# Vivado block design Win_Conditions, xc7a35tcpg236-1, Vivado 2018.3
# (continued, part 2 of 3)
current_bd_instance /Regular_Credit/TRIPLE/TRIPLE_4

# ---- hierarchy /Regular_Credit/TRIPLE/TRIPLE_5 ----
current_bd_instance /Regular_Credit/TRIPLE/TRIPLE_5
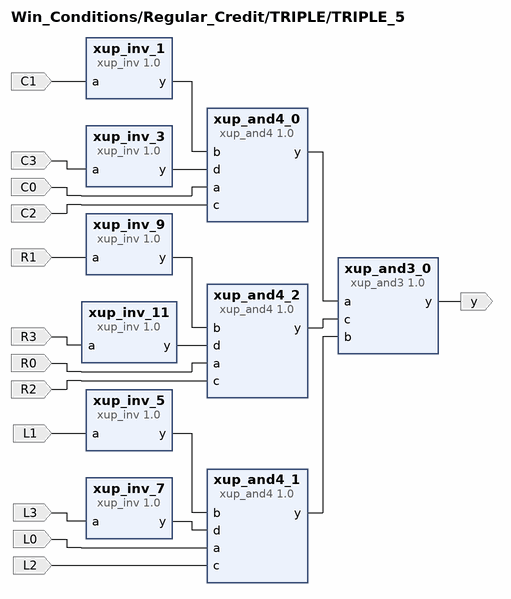
[diagram p22: block diagram inside /Regular_Credit/TRIPLE/TRIPLE_5]
create_bd_pin -dir I C0
create_bd_pin -dir I C1
create_bd_pin -dir I C2
create_bd_pin -dir I C3
create_bd_pin -dir I L0
create_bd_pin -dir I L1
create_bd_pin -dir I L2
create_bd_pin -dir I L3
create_bd_pin -dir I R0
create_bd_pin -dir I R1
create_bd_pin -dir I R2
create_bd_pin -dir I R3
create_bd_pin -dir O y

create_bd_cell -type ip -vlnv xilinx.com:xup:xup_and4:1.0 xup_and4_0
set_property -dict {CONFIG.DELAY 0} [get_bd_cells xup_and4_0]
create_bd_cell -type ip -vlnv xilinx.com:xup:xup_and4:1.0 xup_and4_1
set_property -dict {CONFIG.DELAY 0} [get_bd_cells xup_and4_1]
create_bd_cell -type ip -vlnv xilinx.com:xup:xup_and4:1.0 xup_and4_2
set_property -dict {CONFIG.DELAY 0} [get_bd_cells xup_and4_2]
create_bd_cell -type ip -vlnv xilinx.com:xup:xup_and3:1.0 xup_and3_0
set_property -dict {CONFIG.DELAY 0} [get_bd_cells xup_and3_0]
create_bd_cell -type ip -vlnv xilinx.com:xup:xup_inv:1.0 xup_inv_1
set_property -dict {CONFIG.DELAY 0} [get_bd_cells xup_inv_1]
create_bd_cell -type ip -vlnv xilinx.com:xup:xup_inv:1.0 xup_inv_3
set_property -dict {CONFIG.DELAY 0} [get_bd_cells xup_inv_3]
create_bd_cell -type ip -vlnv xilinx.com:xup:xup_inv:1.0 xup_inv_5
set_property -dict {CONFIG.DELAY 0} [get_bd_cells xup_inv_5]
create_bd_cell -type ip -vlnv xilinx.com:xup:xup_inv:1.0 xup_inv_7
set_property -dict {CONFIG.DELAY 0} [get_bd_cells xup_inv_7]
create_bd_cell -type ip -vlnv xilinx.com:xup:xup_inv:1.0 xup_inv_9
set_property -dict {CONFIG.DELAY 0} [get_bd_cells xup_inv_9]
create_bd_cell -type ip -vlnv xilinx.com:xup:xup_inv:1.0 xup_inv_11
set_property -dict {CONFIG.DELAY 0} [get_bd_cells xup_inv_11]

# ---- hierarchy /Regular_Credit/TRIPLE/TRIPLE_9 ----
current_bd_instance /Regular_Credit/TRIPLE/TRIPLE_9
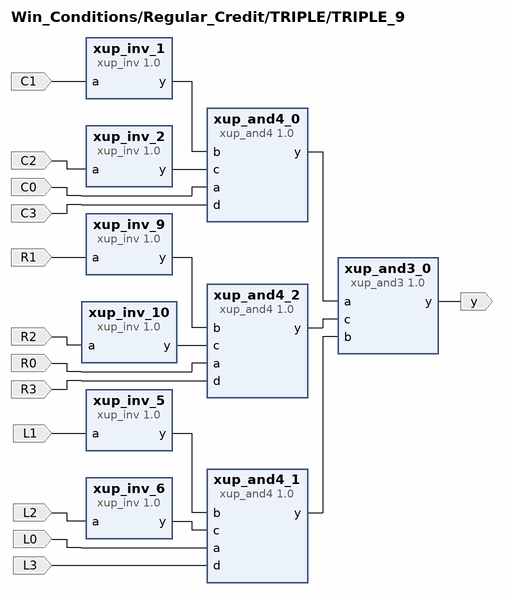
[diagram p23: block diagram inside /Regular_Credit/TRIPLE/TRIPLE_9]
create_bd_pin -dir I C0
create_bd_pin -dir I C1
create_bd_pin -dir I C2
create_bd_pin -dir I C3
create_bd_pin -dir I L0
create_bd_pin -dir I L1
create_bd_pin -dir I L2
create_bd_pin -dir I L3
create_bd_pin -dir I R0
create_bd_pin -dir I R1
create_bd_pin -dir I R2
create_bd_pin -dir I R3
create_bd_pin -dir O y

create_bd_cell -type ip -vlnv xilinx.com:xup:xup_and4:1.0 xup_and4_0
set_property -dict {CONFIG.DELAY 0} [get_bd_cells xup_and4_0]
create_bd_cell -type ip -vlnv xilinx.com:xup:xup_and4:1.0 xup_and4_1
set_property -dict {CONFIG.DELAY 0} [get_bd_cells xup_and4_1]
create_bd_cell -type ip -vlnv xilinx.com:xup:xup_and4:1.0 xup_and4_2
set_property -dict {CONFIG.DELAY 0} [get_bd_cells xup_and4_2]
create_bd_cell -type ip -vlnv xilinx.com:xup:xup_and3:1.0 xup_and3_0
set_property -dict {CONFIG.DELAY 0} [get_bd_cells xup_and3_0]
create_bd_cell -type ip -vlnv xilinx.com:xup:xup_inv:1.0 xup_inv_1
set_property -dict {CONFIG.DELAY 0} [get_bd_cells xup_inv_1]
create_bd_cell -type ip -vlnv xilinx.com:xup:xup_inv:1.0 xup_inv_2
set_property -dict {CONFIG.DELAY 0} [get_bd_cells xup_inv_2]
create_bd_cell -type ip -vlnv xilinx.com:xup:xup_inv:1.0 xup_inv_5
set_property -dict {CONFIG.DELAY 0} [get_bd_cells xup_inv_5]
create_bd_cell -type ip -vlnv xilinx.com:xup:xup_inv:1.0 xup_inv_6
set_property -dict {CONFIG.DELAY 0} [get_bd_cells xup_inv_6]
create_bd_cell -type ip -vlnv xilinx.com:xup:xup_inv:1.0 xup_inv_9
set_property -dict {CONFIG.DELAY 0} [get_bd_cells xup_inv_9]
create_bd_cell -type ip -vlnv xilinx.com:xup:xup_inv:1.0 xup_inv_10
set_property -dict {CONFIG.DELAY 0} [get_bd_cells xup_inv_10]

# ---- connections ----

current_bd_instance /Regular_Credit
connect_bd_net -net DOUBLE_0_y [get_bd_pins DOUBLE/y] [get_bd_pins xup_or5_0/a]
connect_bd_net -net DOUBLE_1_y [get_bd_pins DOUBLE/y1] [get_bd_pins xup_or5_0/b]
connect_bd_net -net DOUBLE_2_y [get_bd_pins DOUBLE/y2] [get_bd_pins xup_or5_0/c]
connect_bd_net -net DOUBLE_3_y [get_bd_pins DOUBLE/y3] [get_bd_pins xup_or5_0/d]
connect_bd_net -net DOUBLE_4_y [get_bd_pins DOUBLE/y4] [get_bd_pins xup_or5_0/e]
connect_bd_net [get_bd_pins xup_or5_0/y] [get_bd_pins xup_or4_0/a]
connect_bd_net -net DOUBLE_5_y [get_bd_pins DOUBLE/y5] [get_bd_pins xup_or5_1/a]
connect_bd_net -net DOUBLE_6_y [get_bd_pins DOUBLE/y6] [get_bd_pins xup_or5_1/b]
connect_bd_net -net DOUBLE_7_y [get_bd_pins DOUBLE/y7] [get_bd_pins xup_or5_1/c]
connect_bd_net -net DOUBLE_8_y [get_bd_pins DOUBLE/y8] [get_bd_pins xup_or5_1/d]
connect_bd_net -net DOUBLE_9_y [get_bd_pins DOUBLE/y9] [get_bd_pins xup_or5_1/e]
connect_bd_net [get_bd_pins xup_or5_1/y] [get_bd_pins xup_or4_0/b]
connect_bd_net -net TRIPLE_0_y [get_bd_pins TRIPLE/y3] [get_bd_pins xup_or5_2/a]
connect_bd_net -net TRIPLE_1_y [get_bd_pins TRIPLE/y4] [get_bd_pins xup_or5_2/b]
connect_bd_net -net TRIPLE_2_y [get_bd_pins TRIPLE/y5] [get_bd_pins xup_or5_2/c]
connect_bd_net -net TRIPLE_3_y [get_bd_pins TRIPLE/y6] [get_bd_pins xup_or5_2/d]
connect_bd_net -net TRIPLE_4_y [get_bd_pins TRIPLE/y7] [get_bd_pins xup_or5_2/e]
connect_bd_net [get_bd_pins xup_or5_2/y] [get_bd_pins xup_or4_0/c]
connect_bd_net -net TRIPLE_5_y [get_bd_pins TRIPLE/y8] [get_bd_pins xup_or5_3/a]
connect_bd_net -net TRIPLE_6_y [get_bd_pins TRIPLE/y] [get_bd_pins xup_or5_3/b]
connect_bd_net -net TRIPLE_7_y [get_bd_pins TRIPLE/y1] [get_bd_pins xup_or5_3/c]
connect_bd_net -net TRIPLE_8_y [get_bd_pins TRIPLE/y2] [get_bd_pins xup_or5_3/d]
connect_bd_net -net TRIPLE_9_y [get_bd_pins TRIPLE/y9] [get_bd_pins xup_or5_3/e]
connect_bd_net [get_bd_pins xup_or5_3/y] [get_bd_pins xup_or4_0/d]
connect_bd_net [get_bd_pins xup_or4_0/y] [get_bd_pins Victory]
connect_bd_net -net a_0_1 [get_bd_pins L3] [get_bd_pins xlconcat_0/In3] [get_bd_pins DOUBLE/L3] [get_bd_pins TRIPLE/L3]
connect_bd_net -net b_0_1 [get_bd_pins L2] [get_bd_pins xlconcat_0/In2] [get_bd_pins DOUBLE/L2] [get_bd_pins TRIPLE/L2]
connect_bd_net -net c_0_1 [get_bd_pins L1] [get_bd_pins xlconcat_0/In1] [get_bd_pins DOUBLE/L1] [get_bd_pins TRIPLE/L1]
connect_bd_net -net d_0_1 [get_bd_pins L0] [get_bd_pins xlconcat_0/In0] [get_bd_pins DOUBLE/L0] [get_bd_pins TRIPLE/L0]
connect_bd_net -net a_0_2 [get_bd_pins C3] [get_bd_pins xlconcat_1/In3] [get_bd_pins DOUBLE/C3] [get_bd_pins TRIPLE/C3]
connect_bd_net -net b_0_2 [get_bd_pins C2] [get_bd_pins xlconcat_1/In2] [get_bd_pins DOUBLE/C2] [get_bd_pins TRIPLE/C2]
connect_bd_net -net c_0_2 [get_bd_pins C1] [get_bd_pins xlconcat_1/In1] [get_bd_pins DOUBLE/C1] [get_bd_pins TRIPLE/C1]
connect_bd_net -net d_0_2 [get_bd_pins C0] [get_bd_pins xlconcat_1/In0] [get_bd_pins DOUBLE/C0] [get_bd_pins TRIPLE/C0]
connect_bd_net -net a_0_3 [get_bd_pins R3] [get_bd_pins xlconcat_2/In3] [get_bd_pins DOUBLE/R3] [get_bd_pins TRIPLE/R3]
connect_bd_net -net b_0_3 [get_bd_pins R2] [get_bd_pins xlconcat_2/In2] [get_bd_pins DOUBLE/R2] [get_bd_pins TRIPLE/R2]
connect_bd_net -net c_0_3 [get_bd_pins R1] [get_bd_pins xlconcat_2/In1] [get_bd_pins DOUBLE/R1] [get_bd_pins TRIPLE/R1]
connect_bd_net -net d_0_3 [get_bd_pins R0] [get_bd_pins xlconcat_2/In0] [get_bd_pins DOUBLE/R0] [get_bd_pins TRIPLE/R0]
connect_bd_net [get_bd_pins xlconcat_0/dout] [get_bd_pins L]
connect_bd_net [get_bd_pins xlconcat_1/dout] [get_bd_pins C]
connect_bd_net [get_bd_pins xlconcat_2/dout] [get_bd_pins R]

current_bd_instance /Regular_Credit/DOUBLE
connect_bd_net -net a_0_1 [get_bd_pins L3] \
  [get_bd_pins DOUBLE_1/L3] [get_bd_pins DOUBLE_3/L3] [get_bd_pins DOUBLE_4/L3] [get_bd_pins DOUBLE_5/L3] \
  [get_bd_pins DOUBLE_6/L3] [get_bd_pins DOUBLE_7/L3] [get_bd_pins DOUBLE_8/L3] [get_bd_pins DOUBLE_9/L3] \
  [get_bd_pins DOUBLE_2/L3] [get_bd_pins DOUBLE_0/L3]
connect_bd_net -net b_0_1 [get_bd_pins L2] \
  [get_bd_pins DOUBLE_1/L2] [get_bd_pins DOUBLE_3/L2] [get_bd_pins DOUBLE_4/L2] [get_bd_pins DOUBLE_5/L2] \
  [get_bd_pins DOUBLE_6/L2] [get_bd_pins DOUBLE_7/L2] [get_bd_pins DOUBLE_8/L2] [get_bd_pins DOUBLE_9/L2] \
  [get_bd_pins DOUBLE_2/L2] [get_bd_pins DOUBLE_0/L2]
connect_bd_net -net c_0_1 [get_bd_pins L1] \
  [get_bd_pins DOUBLE_1/L1] [get_bd_pins DOUBLE_3/L1] [get_bd_pins DOUBLE_4/L1] [get_bd_pins DOUBLE_5/L1] \
  [get_bd_pins DOUBLE_6/L1] [get_bd_pins DOUBLE_7/L1] [get_bd_pins DOUBLE_8/L1] [get_bd_pins DOUBLE_9/L1] \
  [get_bd_pins DOUBLE_2/L1] [get_bd_pins DOUBLE_0/L1]
connect_bd_net -net d_0_1 [get_bd_pins L0] \
  [get_bd_pins DOUBLE_1/L0] [get_bd_pins DOUBLE_3/L0] [get_bd_pins DOUBLE_4/L0] [get_bd_pins DOUBLE_5/L0] \
  [get_bd_pins DOUBLE_6/L0] [get_bd_pins DOUBLE_7/L0] [get_bd_pins DOUBLE_8/L0] [get_bd_pins DOUBLE_9/L0] \
  [get_bd_pins DOUBLE_2/L0] [get_bd_pins DOUBLE_0/L0]
connect_bd_net -net a_0_2 [get_bd_pins C3] \
  [get_bd_pins DOUBLE_1/C3] [get_bd_pins DOUBLE_3/C3] [get_bd_pins DOUBLE_4/C3] [get_bd_pins DOUBLE_5/C3] \
  [get_bd_pins DOUBLE_6/C3] [get_bd_pins DOUBLE_7/C3] [get_bd_pins DOUBLE_8/C3] [get_bd_pins DOUBLE_9/C3] \
  [get_bd_pins DOUBLE_2/C3] [get_bd_pins DOUBLE_0/C3]
connect_bd_net -net b_0_2 [get_bd_pins C2] \
  [get_bd_pins DOUBLE_1/C2] [get_bd_pins DOUBLE_3/C2] [get_bd_pins DOUBLE_4/C2] [get_bd_pins DOUBLE_5/C2] \
  [get_bd_pins DOUBLE_6/C2] [get_bd_pins DOUBLE_7/C2] [get_bd_pins DOUBLE_8/C2] [get_bd_pins DOUBLE_9/C2] \
  [get_bd_pins DOUBLE_2/C2] [get_bd_pins DOUBLE_0/C2]
connect_bd_net -net c_0_2 [get_bd_pins C1] \
  [get_bd_pins DOUBLE_1/C1] [get_bd_pins DOUBLE_3/C1] [get_bd_pins DOUBLE_4/C1] [get_bd_pins DOUBLE_5/C1] \
  [get_bd_pins DOUBLE_6/C1] [get_bd_pins DOUBLE_7/C1] [get_bd_pins DOUBLE_8/C1] [get_bd_pins DOUBLE_9/C1] \
  [get_bd_pins DOUBLE_2/C1] [get_bd_pins DOUBLE_0/C1]
connect_bd_net -net d_0_2 [get_bd_pins C0] \
  [get_bd_pins DOUBLE_1/C0] [get_bd_pins DOUBLE_3/C0] [get_bd_pins DOUBLE_4/C0] [get_bd_pins DOUBLE_5/C0] \
  [get_bd_pins DOUBLE_6/C0] [get_bd_pins DOUBLE_7/C0] [get_bd_pins DOUBLE_8/C0] [get_bd_pins DOUBLE_9/C0] \
  [get_bd_pins DOUBLE_2/C0] [get_bd_pins DOUBLE_0/C0]
connect_bd_net -net a_0_3 [get_bd_pins R3] \
  [get_bd_pins DOUBLE_1/R3] [get_bd_pins DOUBLE_3/R3] [get_bd_pins DOUBLE_4/R3] [get_bd_pins DOUBLE_5/R3] \
  [get_bd_pins DOUBLE_6/R3] [get_bd_pins DOUBLE_7/R3] [get_bd_pins DOUBLE_8/R3] [get_bd_pins DOUBLE_9/R3] \
  [get_bd_pins DOUBLE_2/R3] [get_bd_pins DOUBLE_0/R3]
connect_bd_net -net b_0_3 [get_bd_pins R2] \
  [get_bd_pins DOUBLE_1/R2] [get_bd_pins DOUBLE_3/R2] [get_bd_pins DOUBLE_4/R2] [get_bd_pins DOUBLE_5/R2] \
  [get_bd_pins DOUBLE_6/R2] [get_bd_pins DOUBLE_7/R2] [get_bd_pins DOUBLE_8/R2] [get_bd_pins DOUBLE_9/R2] \
  [get_bd_pins DOUBLE_2/R2] [get_bd_pins DOUBLE_0/R2]
connect_bd_net -net c_0_3 [get_bd_pins R1] \
  [get_bd_pins DOUBLE_1/R1] [get_bd_pins DOUBLE_3/R1] [get_bd_pins DOUBLE_4/R1] [get_bd_pins DOUBLE_5/R1] \
  [get_bd_pins DOUBLE_6/R1] [get_bd_pins DOUBLE_7/R1] [get_bd_pins DOUBLE_8/R1] [get_bd_pins DOUBLE_9/R1] \
  [get_bd_pins DOUBLE_2/R1] [get_bd_pins DOUBLE_0/R1]
connect_bd_net -net d_0_3 [get_bd_pins R0] \
  [get_bd_pins DOUBLE_1/R0] [get_bd_pins DOUBLE_3/R0] [get_bd_pins DOUBLE_4/R0] [get_bd_pins DOUBLE_5/R0] \
  [get_bd_pins DOUBLE_6/R0] [get_bd_pins DOUBLE_7/R0] [get_bd_pins DOUBLE_8/R0] [get_bd_pins DOUBLE_9/R0] \
  [get_bd_pins DOUBLE_2/R0] [get_bd_pins DOUBLE_0/R0]
connect_bd_net [get_bd_pins DOUBLE_0/y] [get_bd_pins y]
connect_bd_net [get_bd_pins DOUBLE_1/y] [get_bd_pins y1]
connect_bd_net [get_bd_pins DOUBLE_2/y] [get_bd_pins y2]
connect_bd_net [get_bd_pins DOUBLE_3/y] [get_bd_pins y3]
connect_bd_net [get_bd_pins DOUBLE_4/y] [get_bd_pins y4]
connect_bd_net [get_bd_pins DOUBLE_5/y] [get_bd_pins y5]
connect_bd_net [get_bd_pins DOUBLE_6/y] [get_bd_pins y6]
connect_bd_net [get_bd_pins DOUBLE_7/y] [get_bd_pins y7]
connect_bd_net [get_bd_pins DOUBLE_8/y] [get_bd_pins y8]
connect_bd_net [get_bd_pins DOUBLE_9/y] [get_bd_pins y9]

current_bd_instance /Regular_Credit/DOUBLE/DOUBLE_0
connect_bd_net [get_bd_pins xup_and4_0/y] [get_bd_pins xup_and2_0/a] [get_bd_pins xup_and2_1/a]
connect_bd_net [get_bd_pins xup_and2_0/y] [get_bd_pins xup_or3_0/a]
connect_bd_net [get_bd_pins xup_and2_1/y] [get_bd_pins xup_or3_0/b]
connect_bd_net [get_bd_pins xup_and2_2/y] [get_bd_pins xup_or3_0/c]
connect_bd_net [get_bd_pins xup_and4_1/y] [get_bd_pins xup_and2_0/b] [get_bd_pins xup_and2_2/a]
connect_bd_net [get_bd_pins xup_and4_3/y] [get_bd_pins xup_and2_1/b] [get_bd_pins xup_and2_2/b]
connect_bd_net -net L3_1 [get_bd_pins L3] [get_bd_pins xup_inv_0/a]
connect_bd_net [get_bd_pins xup_inv_0/y] [get_bd_pins xup_and4_0/a]
connect_bd_net -net L2_1 [get_bd_pins L2] [get_bd_pins xup_inv_1/a]
connect_bd_net [get_bd_pins xup_inv_1/y] [get_bd_pins xup_and4_0/b]
connect_bd_net -net L1_1 [get_bd_pins L1] [get_bd_pins xup_inv_2/a]
connect_bd_net [get_bd_pins xup_inv_2/y] [get_bd_pins xup_and4_0/c]
connect_bd_net -net L0_1 [get_bd_pins L0] [get_bd_pins xup_inv_3/a]
connect_bd_net [get_bd_pins xup_inv_3/y] [get_bd_pins xup_and4_0/d]
connect_bd_net [get_bd_pins xup_inv_4/y] [get_bd_pins xup_and4_3/a]
connect_bd_net [get_bd_pins xup_inv_5/y] [get_bd_pins xup_and4_3/b]
connect_bd_net [get_bd_pins xup_inv_6/y] [get_bd_pins xup_and4_3/c]
connect_bd_net [get_bd_pins xup_inv_7/y] [get_bd_pins xup_and4_3/d]
connect_bd_net -net R3_1 [get_bd_pins R3] [get_bd_pins xup_inv_4/a]
connect_bd_net -net R2_1 [get_bd_pins R2] [get_bd_pins xup_inv_5/a]
connect_bd_net -net R1_1 [get_bd_pins R1] [get_bd_pins xup_inv_6/a]
connect_bd_net -net R0_1 [get_bd_pins R0] [get_bd_pins xup_inv_7/a]
connect_bd_net -net C3_1 [get_bd_pins C3] [get_bd_pins xup_inv_8/a]
connect_bd_net [get_bd_pins xup_inv_8/y] [get_bd_pins xup_and4_1/a]
connect_bd_net -net C2_1 [get_bd_pins C2] [get_bd_pins xup_inv_9/a]
connect_bd_net [get_bd_pins xup_inv_9/y] [get_bd_pins xup_and4_1/b]
connect_bd_net -net C1_1 [get_bd_pins C1] [get_bd_pins xup_inv_10/a]
connect_bd_net [get_bd_pins xup_inv_10/y] [get_bd_pins xup_and4_1/c]
connect_bd_net -net C0_1 [get_bd_pins C0] [get_bd_pins xup_inv_11/a]
connect_bd_net [get_bd_pins xup_inv_11/y] [get_bd_pins xup_and4_1/d]
connect_bd_net [get_bd_pins xup_or3_0/y] [get_bd_pins y]

current_bd_instance /Regular_Credit/DOUBLE/DOUBLE_1
connect_bd_net [get_bd_pins xup_and4_0/y] [get_bd_pins xup_and2_0/a] [get_bd_pins xup_and2_1/a]
connect_bd_net [get_bd_pins xup_and2_0/y] [get_bd_pins xup_or3_0/a]
connect_bd_net [get_bd_pins xup_and2_1/y] [get_bd_pins xup_or3_0/b]
connect_bd_net [get_bd_pins xup_and2_2/y] [get_bd_pins xup_or3_0/c]
connect_bd_net [get_bd_pins xup_and4_1/y] [get_bd_pins xup_and2_0/b] [get_bd_pins xup_and2_2/a]
connect_bd_net [get_bd_pins xup_and4_3/y] [get_bd_pins xup_and2_1/b] [get_bd_pins xup_and2_2/b]
connect_bd_net -net L3_1 [get_bd_pins L3] [get_bd_pins xup_inv_0/a]
connect_bd_net [get_bd_pins xup_inv_0/y] [get_bd_pins xup_and4_0/a]
connect_bd_net -net L2_1 [get_bd_pins L2] [get_bd_pins xup_inv_1/a]
connect_bd_net [get_bd_pins xup_inv_1/y] [get_bd_pins xup_and4_0/b]
connect_bd_net -net L1_1 [get_bd_pins L1] [get_bd_pins xup_inv_2/a]
connect_bd_net [get_bd_pins xup_inv_2/y] [get_bd_pins xup_and4_0/c]
connect_bd_net [get_bd_pins xup_inv_4/y] [get_bd_pins xup_and4_3/a]
connect_bd_net [get_bd_pins xup_inv_5/y] [get_bd_pins xup_and4_3/b]
connect_bd_net [get_bd_pins xup_inv_6/y] [get_bd_pins xup_and4_3/c]
connect_bd_net -net R3_1 [get_bd_pins R3] [get_bd_pins xup_inv_4/a]
connect_bd_net -net R2_1 [get_bd_pins R2] [get_bd_pins xup_inv_5/a]
connect_bd_net -net R1_1 [get_bd_pins R1] [get_bd_pins xup_inv_6/a]
connect_bd_net -net C3_1 [get_bd_pins C3] [get_bd_pins xup_inv_8/a]
connect_bd_net [get_bd_pins xup_inv_8/y] [get_bd_pins xup_and4_1/a]
connect_bd_net -net C2_1 [get_bd_pins C2] [get_bd_pins xup_inv_9/a]
connect_bd_net [get_bd_pins xup_inv_9/y] [get_bd_pins xup_and4_1/b]
connect_bd_net -net C1_1 [get_bd_pins C1] [get_bd_pins xup_inv_10/a]
connect_bd_net [get_bd_pins xup_inv_10/y] [get_bd_pins xup_and4_1/c]
connect_bd_net -net L0_1 [get_bd_pins L0] [get_bd_pins xup_and4_0/d]
connect_bd_net -net C0_1 [get_bd_pins C0] [get_bd_pins xup_and4_1/d]
connect_bd_net -net R0_1 [get_bd_pins R0] [get_bd_pins xup_and4_3/d]
connect_bd_net [get_bd_pins xup_or3_0/y] [get_bd_pins y]

current_bd_instance /Regular_Credit/DOUBLE/DOUBLE_2
connect_bd_net [get_bd_pins xup_and4_0/y] [get_bd_pins xup_and2_0/a] [get_bd_pins xup_and2_1/a]
connect_bd_net [get_bd_pins xup_and2_0/y] [get_bd_pins xup_or3_0/a]
connect_bd_net [get_bd_pins xup_and2_1/y] [get_bd_pins xup_or3_0/b]
connect_bd_net [get_bd_pins xup_and2_2/y] [get_bd_pins xup_or3_0/c]
connect_bd_net [get_bd_pins xup_and4_1/y] [get_bd_pins xup_and2_0/b] [get_bd_pins xup_and2_2/a]
connect_bd_net [get_bd_pins xup_and4_3/y] [get_bd_pins xup_and2_1/b] [get_bd_pins xup_and2_2/b]
connect_bd_net -net L3_1 [get_bd_pins L3] [get_bd_pins xup_inv_0/a]
connect_bd_net [get_bd_pins xup_inv_0/y] [get_bd_pins xup_and4_0/a]
connect_bd_net -net L2_1 [get_bd_pins L2] [get_bd_pins xup_inv_1/a]
connect_bd_net [get_bd_pins xup_inv_1/y] [get_bd_pins xup_and4_0/b]
connect_bd_net -net L0_1 [get_bd_pins L0] [get_bd_pins xup_inv_3/a]
connect_bd_net [get_bd_pins xup_inv_3/y] [get_bd_pins xup_and4_0/d]
connect_bd_net [get_bd_pins xup_inv_4/y] [get_bd_pins xup_and4_3/a]
connect_bd_net [get_bd_pins xup_inv_5/y] [get_bd_pins xup_and4_3/b]
connect_bd_net [get_bd_pins xup_inv_7/y] [get_bd_pins xup_and4_3/d]
connect_bd_net -net R3_1 [get_bd_pins R3] [get_bd_pins xup_inv_4/a]
connect_bd_net -net R2_1 [get_bd_pins R2] [get_bd_pins xup_inv_5/a]
connect_bd_net -net R0_1 [get_bd_pins R0] [get_bd_pins xup_inv_7/a]
connect_bd_net -net C3_1 [get_bd_pins C3] [get_bd_pins xup_inv_8/a]
connect_bd_net [get_bd_pins xup_inv_8/y] [get_bd_pins xup_and4_1/a]
connect_bd_net -net C2_1 [get_bd_pins C2] [get_bd_pins xup_inv_9/a]
connect_bd_net [get_bd_pins xup_inv_9/y] [get_bd_pins xup_and4_1/b]
connect_bd_net -net C0_1 [get_bd_pins C0] [get_bd_pins xup_inv_11/a]
connect_bd_net [get_bd_pins xup_inv_11/y] [get_bd_pins xup_and4_1/d]
connect_bd_net -net L1_1 [get_bd_pins L1] [get_bd_pins xup_and4_0/c]
connect_bd_net -net C1_1 [get_bd_pins C1] [get_bd_pins xup_and4_1/c]
connect_bd_net -net R1_1 [get_bd_pins R1] [get_bd_pins xup_and4_3/c]
connect_bd_net [get_bd_pins xup_or3_0/y] [get_bd_pins y]

current_bd_instance /Regular_Credit/DOUBLE/DOUBLE_3
connect_bd_net [get_bd_pins xup_and4_0/y] [get_bd_pins xup_and2_0/a] [get_bd_pins xup_and2_1/a]
connect_bd_net [get_bd_pins xup_and2_0/y] [get_bd_pins xup_or3_0/a]
connect_bd_net [get_bd_pins xup_and2_1/y] [get_bd_pins xup_or3_0/b]
connect_bd_net [get_bd_pins xup_and2_2/y] [get_bd_pins xup_or3_0/c]
connect_bd_net [get_bd_pins xup_and4_1/y] [get_bd_pins xup_and2_0/b] [get_bd_pins xup_and2_2/a]
connect_bd_net [get_bd_pins xup_and4_3/y] [get_bd_pins xup_and2_1/b] [get_bd_pins xup_and2_2/b]
connect_bd_net -net L3_1 [get_bd_pins L3] [get_bd_pins xup_inv_0/a]
connect_bd_net [get_bd_pins xup_inv_0/y] [get_bd_pins xup_and4_0/a]
connect_bd_net -net L2_1 [get_bd_pins L2] [get_bd_pins xup_inv_1/a]
connect_bd_net [get_bd_pins xup_inv_1/y] [get_bd_pins xup_and4_0/b]
connect_bd_net [get_bd_pins xup_inv_4/y] [get_bd_pins xup_and4_3/a]
connect_bd_net [get_bd_pins xup_inv_5/y] [get_bd_pins xup_and4_3/b]
connect_bd_net -net R3_1 [get_bd_pins R3] [get_bd_pins xup_inv_4/a]
connect_bd_net -net R2_1 [get_bd_pins R2] [get_bd_pins xup_inv_5/a]
connect_bd_net -net C3_1 [get_bd_pins C3] [get_bd_pins xup_inv_8/a]
connect_bd_net [get_bd_pins xup_inv_8/y] [get_bd_pins xup_and4_1/a]
connect_bd_net -net C2_1 [get_bd_pins C2] [get_bd_pins xup_inv_9/a]
connect_bd_net [get_bd_pins xup_inv_9/y] [get_bd_pins xup_and4_1/b]
connect_bd_net -net L1_1 [get_bd_pins L1] [get_bd_pins xup_and4_0/c]
connect_bd_net -net L0_1 [get_bd_pins L0] [get_bd_pins xup_and4_0/d]
connect_bd_net -net C1_1 [get_bd_pins C1] [get_bd_pins xup_and4_1/c]
connect_bd_net -net C0_1 [get_bd_pins C0] [get_bd_pins xup_and4_1/d]
connect_bd_net -net R1_1 [get_bd_pins R1] [get_bd_pins xup_and4_3/c]
connect_bd_net -net R0_1 [get_bd_pins R0] [get_bd_pins xup_and4_3/d]
connect_bd_net [get_bd_pins xup_or3_0/y] [get_bd_pins y]

current_bd_instance /Regular_Credit/DOUBLE/DOUBLE_4
connect_bd_net [get_bd_pins xup_and4_0/y] [get_bd_pins xup_and2_0/a] [get_bd_pins xup_and2_1/a]
connect_bd_net [get_bd_pins xup_and2_0/y] [get_bd_pins xup_or3_0/a]
connect_bd_net [get_bd_pins xup_and2_1/y] [get_bd_pins xup_or3_0/b]
connect_bd_net [get_bd_pins xup_and2_2/y] [get_bd_pins xup_or3_0/c]
connect_bd_net [get_bd_pins xup_and4_1/y] [get_bd_pins xup_and2_0/b] [get_bd_pins xup_and2_2/a]
connect_bd_net [get_bd_pins xup_and4_3/y] [get_bd_pins xup_and2_1/b] [get_bd_pins xup_and2_2/b]
connect_bd_net -net L3_1 [get_bd_pins L3] [get_bd_pins xup_inv_0/a]
connect_bd_net [get_bd_pins xup_inv_0/y] [get_bd_pins xup_and4_0/a]
connect_bd_net -net L1_1 [get_bd_pins L1] [get_bd_pins xup_inv_2/a]
connect_bd_net [get_bd_pins xup_inv_2/y] [get_bd_pins xup_and4_0/c]
connect_bd_net -net L0_1 [get_bd_pins L0] [get_bd_pins xup_inv_3/a]
connect_bd_net [get_bd_pins xup_inv_3/y] [get_bd_pins xup_and4_0/d]
connect_bd_net [get_bd_pins xup_inv_4/y] [get_bd_pins xup_and4_3/a]
connect_bd_net [get_bd_pins xup_inv_6/y] [get_bd_pins xup_and4_3/c]
connect_bd_net [get_bd_pins xup_inv_7/y] [get_bd_pins xup_and4_3/d]
connect_bd_net -net R3_1 [get_bd_pins R3] [get_bd_pins xup_inv_4/a]
connect_bd_net -net R1_1 [get_bd_pins R1] [get_bd_pins xup_inv_6/a]
connect_bd_net -net R0_1 [get_bd_pins R0] [get_bd_pins xup_inv_7/a]
connect_bd_net -net C3_1 [get_bd_pins C3] [get_bd_pins xup_inv_8/a]
connect_bd_net [get_bd_pins xup_inv_8/y] [get_bd_pins xup_and4_1/a]
connect_bd_net -net C1_1 [get_bd_pins C1] [get_bd_pins xup_inv_10/a]
connect_bd_net [get_bd_pins xup_inv_10/y] [get_bd_pins xup_and4_1/c]
connect_bd_net -net C0_1 [get_bd_pins C0] [get_bd_pins xup_inv_11/a]
connect_bd_net [get_bd_pins xup_inv_11/y] [get_bd_pins xup_and4_1/d]
connect_bd_net -net L2_1 [get_bd_pins L2] [get_bd_pins xup_and4_0/b]
connect_bd_net -net C2_1 [get_bd_pins C2] [get_bd_pins xup_and4_1/b]
connect_bd_net -net R2_1 [get_bd_pins R2] [get_bd_pins xup_and4_3/b]
connect_bd_net [get_bd_pins xup_or3_0/y] [get_bd_pins y]

current_bd_instance /Regular_Credit/DOUBLE/DOUBLE_5
connect_bd_net [get_bd_pins xup_and4_0/y] [get_bd_pins xup_and2_0/a] [get_bd_pins xup_and2_1/a]
connect_bd_net [get_bd_pins xup_and2_0/y] [get_bd_pins xup_or3_0/a]
connect_bd_net [get_bd_pins xup_and2_1/y] [get_bd_pins xup_or3_0/b]
connect_bd_net [get_bd_pins xup_and2_2/y] [get_bd_pins xup_or3_0/c]
connect_bd_net [get_bd_pins xup_and4_1/y] [get_bd_pins xup_and2_0/b] [get_bd_pins xup_and2_2/a]
connect_bd_net [get_bd_pins xup_and4_3/y] [get_bd_pins xup_and2_1/b] [get_bd_pins xup_and2_2/b]
connect_bd_net -net L3_1 [get_bd_pins L3] [get_bd_pins xup_inv_0/a]
connect_bd_net [get_bd_pins xup_inv_0/y] [get_bd_pins xup_and4_0/a]
connect_bd_net -net L1_1 [get_bd_pins L1] [get_bd_pins xup_inv_2/a]
connect_bd_net [get_bd_pins xup_inv_2/y] [get_bd_pins xup_and4_0/c]
connect_bd_net [get_bd_pins xup_inv_4/y] [get_bd_pins xup_and4_3/a]
connect_bd_net [get_bd_pins xup_inv_6/y] [get_bd_pins xup_and4_3/c]
connect_bd_net -net R3_1 [get_bd_pins R3] [get_bd_pins xup_inv_4/a]
connect_bd_net -net R1_1 [get_bd_pins R1] [get_bd_pins xup_inv_6/a]
connect_bd_net -net C3_1 [get_bd_pins C3] [get_bd_pins xup_inv_8/a]
connect_bd_net [get_bd_pins xup_inv_8/y] [get_bd_pins xup_and4_1/a]
connect_bd_net -net C1_1 [get_bd_pins C1] [get_bd_pins xup_inv_10/a]
connect_bd_net [get_bd_pins xup_inv_10/y] [get_bd_pins xup_and4_1/c]
connect_bd_net -net L2_1 [get_bd_pins L2] [get_bd_pins xup_and4_0/b]
connect_bd_net -net L0_1 [get_bd_pins L0] [get_bd_pins xup_and4_0/d]
connect_bd_net -net C2_1 [get_bd_pins C2] [get_bd_pins xup_and4_1/b]
connect_bd_net -net C0_1 [get_bd_pins C0] [get_bd_pins xup_and4_1/d]
connect_bd_net -net R2_1 [get_bd_pins R2] [get_bd_pins xup_and4_3/b]
connect_bd_net -net R0_1 [get_bd_pins R0] [get_bd_pins xup_and4_3/d]
connect_bd_net [get_bd_pins xup_or3_0/y] [get_bd_pins y]

current_bd_instance /Regular_Credit/DOUBLE/DOUBLE_6
connect_bd_net [get_bd_pins xup_and4_0/y] [get_bd_pins xup_and2_0/a] [get_bd_pins xup_and2_1/a]
connect_bd_net [get_bd_pins xup_and2_0/y] [get_bd_pins xup_or3_0/a]
connect_bd_net [get_bd_pins xup_and2_1/y] [get_bd_pins xup_or3_0/b]
connect_bd_net [get_bd_pins xup_and2_2/y] [get_bd_pins xup_or3_0/c]
connect_bd_net [get_bd_pins xup_and4_1/y] [get_bd_pins xup_and2_0/b] [get_bd_pins xup_and2_2/a]
connect_bd_net [get_bd_pins xup_and4_3/y] [get_bd_pins xup_and2_1/b] [get_bd_pins xup_and2_2/b]
connect_bd_net -net L3_1 [get_bd_pins L3] [get_bd_pins xup_inv_0/a]
connect_bd_net [get_bd_pins xup_inv_0/y] [get_bd_pins xup_and4_0/a]
connect_bd_net -net L0_1 [get_bd_pins L0] [get_bd_pins xup_inv_3/a]
connect_bd_net [get_bd_pins xup_inv_3/y] [get_bd_pins xup_and4_0/d]
connect_bd_net [get_bd_pins xup_inv_4/y] [get_bd_pins xup_and4_3/a]
connect_bd_net [get_bd_pins xup_inv_7/y] [get_bd_pins xup_and4_3/d]
connect_bd_net -net R3_1 [get_bd_pins R3] [get_bd_pins xup_inv_4/a]
connect_bd_net -net R0_1 [get_bd_pins R0] [get_bd_pins xup_inv_7/a]
connect_bd_net -net C3_1 [get_bd_pins C3] [get_bd_pins xup_inv_8/a]
connect_bd_net [get_bd_pins xup_inv_8/y] [get_bd_pins xup_and4_1/a]
connect_bd_net -net C0_1 [get_bd_pins C0] [get_bd_pins xup_inv_11/a]
connect_bd_net [get_bd_pins xup_inv_11/y] [get_bd_pins xup_and4_1/d]
connect_bd_net -net L2_1 [get_bd_pins L2] [get_bd_pins xup_and4_0/b]
connect_bd_net -net L1_1 [get_bd_pins L1] [get_bd_pins xup_and4_0/c]
connect_bd_net -net C2_1 [get_bd_pins C2] [get_bd_pins xup_and4_1/b]
connect_bd_net -net C1_1 [get_bd_pins C1] [get_bd_pins xup_and4_1/c]
connect_bd_net -net R2_1 [get_bd_pins R2] [get_bd_pins xup_and4_3/b]
connect_bd_net -net R1_1 [get_bd_pins R1] [get_bd_pins xup_and4_3/c]
connect_bd_net [get_bd_pins xup_or3_0/y] [get_bd_pins y]

current_bd_instance /Regular_Credit/DOUBLE/DOUBLE_7
connect_bd_net [get_bd_pins xup_and4_0/y] [get_bd_pins xup_and2_0/a] [get_bd_pins xup_and2_1/a]
connect_bd_net [get_bd_pins xup_and2_0/y] [get_bd_pins xup_or3_0/a]
connect_bd_net [get_bd_pins xup_and2_1/y] [get_bd_pins xup_or3_0/b]
connect_bd_net [get_bd_pins xup_and2_2/y] [get_bd_pins xup_or3_0/c]
connect_bd_net [get_bd_pins xup_and4_1/y] [get_bd_pins xup_and2_0/b] [get_bd_pins xup_and2_2/a]
connect_bd_net [get_bd_pins xup_and4_3/y] [get_bd_pins xup_and2_1/b] [get_bd_pins xup_and2_2/b]
connect_bd_net -net L3_1 [get_bd_pins L3] [get_bd_pins xup_inv_0/a]
connect_bd_net [get_bd_pins xup_inv_0/y] [get_bd_pins xup_and4_0/a]
connect_bd_net [get_bd_pins xup_inv_4/y] [get_bd_pins xup_and4_3/a]
connect_bd_net -net R3_1 [get_bd_pins R3] [get_bd_pins xup_inv_4/a]
connect_bd_net -net C3_1 [get_bd_pins C3] [get_bd_pins xup_inv_8/a]
connect_bd_net [get_bd_pins xup_inv_8/y] [get_bd_pins xup_and4_1/a]
connect_bd_net -net L2_1 [get_bd_pins L2] [get_bd_pins xup_and4_0/b]
connect_bd_net -net L1_1 [get_bd_pins L1] [get_bd_pins xup_and4_0/c]
connect_bd_net -net L0_1 [get_bd_pins L0] [get_bd_pins xup_and4_0/d]
connect_bd_net -net C2_1 [get_bd_pins C2] [get_bd_pins xup_and4_1/b]
connect_bd_net -net C1_1 [get_bd_pins C1] [get_bd_pins xup_and4_1/c]
connect_bd_net -net C0_1 [get_bd_pins C0] [get_bd_pins xup_and4_1/d]
connect_bd_net -net R2_1 [get_bd_pins R2] [get_bd_pins xup_and4_3/b]
connect_bd_net -net R1_1 [get_bd_pins R1] [get_bd_pins xup_and4_3/c]
connect_bd_net -net R0_1 [get_bd_pins R0] [get_bd_pins xup_and4_3/d]
connect_bd_net [get_bd_pins xup_or3_0/y] [get_bd_pins y]

current_bd_instance /Regular_Credit/DOUBLE/DOUBLE_8
connect_bd_net [get_bd_pins xup_and4_0/y] [get_bd_pins xup_and2_0/a] [get_bd_pins xup_and2_1/a]
connect_bd_net [get_bd_pins xup_and2_0/y] [get_bd_pins xup_or3_0/a]
connect_bd_net [get_bd_pins xup_and2_1/y] [get_bd_pins xup_or3_0/b]
connect_bd_net [get_bd_pins xup_and2_2/y] [get_bd_pins xup_or3_0/c]
connect_bd_net [get_bd_pins xup_and4_1/y] [get_bd_pins xup_and2_0/b] [get_bd_pins xup_and2_2/a]
connect_bd_net [get_bd_pins xup_and4_3/y] [get_bd_pins xup_and2_1/b] [get_bd_pins xup_and2_2/b]
connect_bd_net -net L2_1 [get_bd_pins L2] [get_bd_pins xup_inv_1/a]
connect_bd_net [get_bd_pins xup_inv_1/y] [get_bd_pins xup_and4_0/b]
connect_bd_net -net L1_1 [get_bd_pins L1] [get_bd_pins xup_inv_2/a]
connect_bd_net [get_bd_pins xup_inv_2/y] [get_bd_pins xup_and4_0/c]
connect_bd_net -net L0_1 [get_bd_pins L0] [get_bd_pins xup_inv_3/a]
connect_bd_net [get_bd_pins xup_inv_3/y] [get_bd_pins xup_and4_0/d]
connect_bd_net [get_bd_pins xup_inv_5/y] [get_bd_pins xup_and4_3/b]
connect_bd_net [get_bd_pins xup_inv_6/y] [get_bd_pins xup_and4_3/c]
connect_bd_net [get_bd_pins xup_inv_7/y] [get_bd_pins xup_and4_3/d]
connect_bd_net -net R2_1 [get_bd_pins R2] [get_bd_pins xup_inv_5/a]
connect_bd_net -net R1_1 [get_bd_pins R1] [get_bd_pins xup_inv_6/a]
connect_bd_net -net R0_1 [get_bd_pins R0] [get_bd_pins xup_inv_7/a]
connect_bd_net -net C2_1 [get_bd_pins C2] [get_bd_pins xup_inv_9/a]
connect_bd_net [get_bd_pins xup_inv_9/y] [get_bd_pins xup_and4_1/b]
connect_bd_net -net C1_1 [get_bd_pins C1] [get_bd_pins xup_inv_10/a]
connect_bd_net [get_bd_pins xup_inv_10/y] [get_bd_pins xup_and4_1/c]
connect_bd_net -net C0_1 [get_bd_pins C0] [get_bd_pins xup_inv_11/a]
connect_bd_net [get_bd_pins xup_inv_11/y] [get_bd_pins xup_and4_1/d]
connect_bd_net -net L3_1 [get_bd_pins L3] [get_bd_pins xup_and4_0/a]
connect_bd_net -net C3_1 [get_bd_pins C3] [get_bd_pins xup_and4_1/a]
connect_bd_net -net R3_1 [get_bd_pins R3] [get_bd_pins xup_and4_3/a]
connect_bd_net [get_bd_pins xup_or3_0/y] [get_bd_pins y]

current_bd_instance /Regular_Credit/DOUBLE/DOUBLE_9
connect_bd_net [get_bd_pins xup_and4_0/y] [get_bd_pins xup_and2_0/a] [get_bd_pins xup_and2_1/a]
connect_bd_net [get_bd_pins xup_and2_0/y] [get_bd_pins xup_or3_0/a]
connect_bd_net [get_bd_pins xup_and2_1/y] [get_bd_pins xup_or3_0/b]
connect_bd_net [get_bd_pins xup_and2_2/y] [get_bd_pins xup_or3_0/c]
connect_bd_net [get_bd_pins xup_and4_1/y] [get_bd_pins xup_and2_0/b] [get_bd_pins xup_and2_2/a]
connect_bd_net [get_bd_pins xup_and4_3/y] [get_bd_pins xup_and2_1/b] [get_bd_pins xup_and2_2/b]
connect_bd_net -net L2_1 [get_bd_pins L2] [get_bd_pins xup_inv_1/a]
connect_bd_net [get_bd_pins xup_inv_1/y] [get_bd_pins xup_and4_0/b]
connect_bd_net -net L1_1 [get_bd_pins L1] [get_bd_pins xup_inv_2/a]
connect_bd_net [get_bd_pins xup_inv_2/y] [get_bd_pins xup_and4_0/c]
connect_bd_net [get_bd_pins xup_inv_5/y] [get_bd_pins xup_and4_3/b]
connect_bd_net [get_bd_pins xup_inv_6/y] [get_bd_pins xup_and4_3/c]
connect_bd_net -net R2_1 [get_bd_pins R2] [get_bd_pins xup_inv_5/a]
connect_bd_net -net R1_1 [get_bd_pins R1] [get_bd_pins xup_inv_6/a]
connect_bd_net -net C2_1 [get_bd_pins C2] [get_bd_pins xup_inv_9/a]
connect_bd_net [get_bd_pins xup_inv_9/y] [get_bd_pins xup_and4_1/b]
connect_bd_net -net C1_1 [get_bd_pins C1] [get_bd_pins xup_inv_10/a]
connect_bd_net [get_bd_pins xup_inv_10/y] [get_bd_pins xup_and4_1/c]
connect_bd_net -net L3_1 [get_bd_pins L3] [get_bd_pins xup_and4_0/a]
connect_bd_net -net L0_1 [get_bd_pins L0] [get_bd_pins xup_and4_0/d]
connect_bd_net -net C3_1 [get_bd_pins C3] [get_bd_pins xup_and4_1/a]
connect_bd_net -net C0_1 [get_bd_pins C0] [get_bd_pins xup_and4_1/d]
connect_bd_net -net R3_1 [get_bd_pins R3] [get_bd_pins xup_and4_3/a]
connect_bd_net -net R0_1 [get_bd_pins R0] [get_bd_pins xup_and4_3/d]
connect_bd_net [get_bd_pins xup_or3_0/y] [get_bd_pins y]

current_bd_instance /Regular_Credit/TRIPLE
connect_bd_net -net d_0_2 [get_bd_pins C0] \
  [get_bd_pins TRIPLE_0/C0] [get_bd_pins TRIPLE_2/C0] [get_bd_pins TRIPLE_3/C0] [get_bd_pins TRIPLE_7/C0] \
  [get_bd_pins TRIPLE_5/C0] [get_bd_pins TRIPLE_1/C0] [get_bd_pins TRIPLE_8/C0] [get_bd_pins TRIPLE_9/C0] \
  [get_bd_pins TRIPLE_4/C0] [get_bd_pins TRIPLE_6/C0]
connect_bd_net -net c_0_2 [get_bd_pins C1] \
  [get_bd_pins TRIPLE_0/C1] [get_bd_pins TRIPLE_2/C1] [get_bd_pins TRIPLE_3/C1] [get_bd_pins TRIPLE_7/C1] \
  [get_bd_pins TRIPLE_5/C1] [get_bd_pins TRIPLE_1/C1] [get_bd_pins TRIPLE_8/C1] [get_bd_pins TRIPLE_9/C1] \
  [get_bd_pins TRIPLE_4/C1] [get_bd_pins TRIPLE_6/C1]
connect_bd_net -net b_0_2 [get_bd_pins C2] \
  [get_bd_pins TRIPLE_0/C2] [get_bd_pins TRIPLE_2/C2] [get_bd_pins TRIPLE_3/C2] [get_bd_pins TRIPLE_7/C2] \
  [get_bd_pins TRIPLE_5/C2] [get_bd_pins TRIPLE_1/C2] [get_bd_pins TRIPLE_8/C2] [get_bd_pins TRIPLE_9/C2] \
  [get_bd_pins TRIPLE_4/C2] [get_bd_pins TRIPLE_6/C2]
connect_bd_net -net a_0_2 [get_bd_pins C3] \
  [get_bd_pins TRIPLE_0/C3] [get_bd_pins TRIPLE_2/C3] [get_bd_pins TRIPLE_3/C3] [get_bd_pins TRIPLE_7/C3] \
  [get_bd_pins TRIPLE_5/C3] [get_bd_pins TRIPLE_1/C3] [get_bd_pins TRIPLE_8/C3] [get_bd_pins TRIPLE_9/C3] \
  [get_bd_pins TRIPLE_4/C3] [get_bd_pins TRIPLE_6/C3]
connect_bd_net -net d_0_1 [get_bd_pins L0] \
  [get_bd_pins TRIPLE_0/L0] [get_bd_pins TRIPLE_2/L0] [get_bd_pins TRIPLE_3/L0] [get_bd_pins TRIPLE_7/L0] \
  [get_bd_pins TRIPLE_5/L0] [get_bd_pins TRIPLE_1/L0] [get_bd_pins TRIPLE_8/L0] [get_bd_pins TRIPLE_9/L0] \
  [get_bd_pins TRIPLE_4/L0] [get_bd_pins TRIPLE_6/L0]
connect_bd_net -net c_0_1 [get_bd_pins L1] \
  [get_bd_pins TRIPLE_0/L1] [get_bd_pins TRIPLE_2/L1] [get_bd_pins TRIPLE_3/L1] [get_bd_pins TRIPLE_7/L1] \
  [get_bd_pins TRIPLE_5/L1] [get_bd_pins TRIPLE_1/L1] [get_bd_pins TRIPLE_8/L1] [get_bd_pins TRIPLE_9/L1] \
  [get_bd_pins TRIPLE_4/L1] [get_bd_pins TRIPLE_6/L1]
connect_bd_net -net b_0_1 [get_bd_pins L2] \
  [get_bd_pins TRIPLE_0/L2] [get_bd_pins TRIPLE_2/L2] [get_bd_pins TRIPLE_3/L2] [get_bd_pins TRIPLE_7/L2] \
  [get_bd_pins TRIPLE_5/L2] [get_bd_pins TRIPLE_1/L2] [get_bd_pins TRIPLE_8/L2] [get_bd_pins TRIPLE_9/L2] \
  [get_bd_pins TRIPLE_4/L2] [get_bd_pins TRIPLE_6/L2]
connect_bd_net -net a_0_1 [get_bd_pins L3] \
  [get_bd_pins TRIPLE_0/L3] [get_bd_pins TRIPLE_2/L3] [get_bd_pins TRIPLE_3/L3] [get_bd_pins TRIPLE_7/L3] \
  [get_bd_pins TRIPLE_5/L3] [get_bd_pins TRIPLE_1/L3] [get_bd_pins TRIPLE_8/L3] [get_bd_pins TRIPLE_9/L3] \
  [get_bd_pins TRIPLE_4/L3] [get_bd_pins TRIPLE_6/L3]
connect_bd_net -net d_0_3 [get_bd_pins R0] \
  [get_bd_pins TRIPLE_0/R0] [get_bd_pins TRIPLE_2/R0] [get_bd_pins TRIPLE_3/R0] [get_bd_pins TRIPLE_7/R0] \
  [get_bd_pins TRIPLE_5/R0] [get_bd_pins TRIPLE_1/R0] [get_bd_pins TRIPLE_8/R0] [get_bd_pins TRIPLE_9/R0] \
  [get_bd_pins TRIPLE_4/R0] [get_bd_pins TRIPLE_6/R0]
connect_bd_net -net c_0_3 [get_bd_pins R1] \
  [get_bd_pins TRIPLE_0/R1] [get_bd_pins TRIPLE_2/R1] [get_bd_pins TRIPLE_3/R1] [get_bd_pins TRIPLE_7/R1] \
  [get_bd_pins TRIPLE_5/R1] [get_bd_pins TRIPLE_1/R1] [get_bd_pins TRIPLE_8/R1] [get_bd_pins TRIPLE_9/R1] \
  [get_bd_pins TRIPLE_4/R1] [get_bd_pins TRIPLE_6/R1]
connect_bd_net -net b_0_3 [get_bd_pins R2] \
  [get_bd_pins TRIPLE_0/R2] [get_bd_pins TRIPLE_2/R2] [get_bd_pins TRIPLE_3/R2] [get_bd_pins TRIPLE_7/R2] \
  [get_bd_pins TRIPLE_5/R2] [get_bd_pins TRIPLE_1/R2] [get_bd_pins TRIPLE_8/R2] [get_bd_pins TRIPLE_9/R2] \
  [get_bd_pins TRIPLE_4/R2] [get_bd_pins TRIPLE_6/R2]
connect_bd_net -net a_0_3 [get_bd_pins R3] \
  [get_bd_pins TRIPLE_0/R3] [get_bd_pins TRIPLE_2/R3] [get_bd_pins TRIPLE_3/R3] [get_bd_pins TRIPLE_7/R3] \
  [get_bd_pins TRIPLE_5/R3] [get_bd_pins TRIPLE_1/R3] [get_bd_pins TRIPLE_8/R3] [get_bd_pins TRIPLE_9/R3] \
  [get_bd_pins TRIPLE_4/R3] [get_bd_pins TRIPLE_6/R3]
connect_bd_net [get_bd_pins TRIPLE_6/y] [get_bd_pins y]
connect_bd_net [get_bd_pins TRIPLE_7/y] [get_bd_pins y1]
connect_bd_net [get_bd_pins TRIPLE_8/y] [get_bd_pins y2]
connect_bd_net [get_bd_pins TRIPLE_0/y] [get_bd_pins y3]
connect_bd_net [get_bd_pins TRIPLE_1/y] [get_bd_pins y4]
connect_bd_net [get_bd_pins TRIPLE_2/y] [get_bd_pins y5]
connect_bd_net [get_bd_pins TRIPLE_3/y] [get_bd_pins y6]
connect_bd_net [get_bd_pins TRIPLE_4/y] [get_bd_pins y7]
connect_bd_net [get_bd_pins TRIPLE_5/y] [get_bd_pins y8]
connect_bd_net [get_bd_pins TRIPLE_9/y] [get_bd_pins y9]

current_bd_instance /Regular_Credit/TRIPLE/TRIPLE_6
connect_bd_net [get_bd_pins xup_and4_0/y] [get_bd_pins xup_and3_0/a]
connect_bd_net [get_bd_pins xup_and4_1/y] [get_bd_pins xup_and3_0/b]
connect_bd_net [get_bd_pins xup_and4_2/y] [get_bd_pins xup_and3_0/c]
connect_bd_net -net C0_1 [get_bd_pins C0] [get_bd_pins xup_inv_0/a]
connect_bd_net [get_bd_pins xup_inv_0/y] [get_bd_pins xup_and4_0/a]
connect_bd_net -net C3_1 [get_bd_pins C3] [get_bd_pins xup_inv_3/a]
connect_bd_net [get_bd_pins xup_inv_3/y] [get_bd_pins xup_and4_0/d]
connect_bd_net -net L0_1 [get_bd_pins L0] [get_bd_pins xup_inv_4/a]
connect_bd_net [get_bd_pins xup_inv_4/y] [get_bd_pins xup_and4_1/a]
connect_bd_net -net L3_1 [get_bd_pins L3] [get_bd_pins xup_inv_7/a]
connect_bd_net [get_bd_pins xup_inv_7/y] [get_bd_pins xup_and4_1/d]
connect_bd_net -net R0_1 [get_bd_pins R0] [get_bd_pins xup_inv_8/a]
connect_bd_net [get_bd_pins xup_inv_8/y] [get_bd_pins xup_and4_2/a]
connect_bd_net -net R3_1 [get_bd_pins R3] [get_bd_pins xup_inv_11/a]
connect_bd_net [get_bd_pins xup_inv_11/y] [get_bd_pins xup_and4_2/d]
connect_bd_net -net C1_1 [get_bd_pins C1] [get_bd_pins xup_and4_0/b]
connect_bd_net -net C2_1 [get_bd_pins C2] [get_bd_pins xup_and4_0/c]
connect_bd_net -net L1_1 [get_bd_pins L1] [get_bd_pins xup_and4_1/b]
connect_bd_net -net L2_1 [get_bd_pins L2] [get_bd_pins xup_and4_1/c]
connect_bd_net -net R1_1 [get_bd_pins R1] [get_bd_pins xup_and4_2/b]
connect_bd_net -net R2_1 [get_bd_pins R2] [get_bd_pins xup_and4_2/c]
connect_bd_net [get_bd_pins xup_and3_0/y] [get_bd_pins y]

current_bd_instance /Regular_Credit/TRIPLE/TRIPLE_7
connect_bd_net [get_bd_pins xup_and4_0/y] [get_bd_pins xup_and3_0/a]
connect_bd_net [get_bd_pins xup_and4_1/y] [get_bd_pins xup_and3_0/b]
connect_bd_net [get_bd_pins xup_and4_2/y] [get_bd_pins xup_and3_0/c]
connect_bd_net -net C3_1 [get_bd_pins C3] [get_bd_pins xup_inv_3/a]
connect_bd_net [get_bd_pins xup_inv_3/y] [get_bd_pins xup_and4_0/d]
connect_bd_net -net L3_1 [get_bd_pins L3] [get_bd_pins xup_inv_7/a]
connect_bd_net [get_bd_pins xup_inv_7/y] [get_bd_pins xup_and4_1/d]
connect_bd_net -net R3_1 [get_bd_pins R3] [get_bd_pins xup_inv_11/a]
connect_bd_net [get_bd_pins xup_inv_11/y] [get_bd_pins xup_and4_2/d]
connect_bd_net -net C0_1 [get_bd_pins C0] [get_bd_pins xup_and4_0/a]
connect_bd_net -net C1_1 [get_bd_pins C1] [get_bd_pins xup_and4_0/b]
connect_bd_net -net C2_1 [get_bd_pins C2] [get_bd_pins xup_and4_0/c]
connect_bd_net -net L0_1 [get_bd_pins L0] [get_bd_pins xup_and4_1/a]
connect_bd_net -net L1_1 [get_bd_pins L1] [get_bd_pins xup_and4_1/b]
connect_bd_net -net L2_1 [get_bd_pins L2] [get_bd_pins xup_and4_1/c]
connect_bd_net -net R0_1 [get_bd_pins R0] [get_bd_pins xup_and4_2/a]
connect_bd_net -net R1_1 [get_bd_pins R1] [get_bd_pins xup_and4_2/b]
connect_bd_net -net R2_1 [get_bd_pins R2] [get_bd_pins xup_and4_2/c]
connect_bd_net [get_bd_pins xup_and3_0/y] [get_bd_pins y]

current_bd_instance /Regular_Credit/TRIPLE/TRIPLE_8
connect_bd_net [get_bd_pins xup_and4_0/y] [get_bd_pins xup_and3_0/a]
connect_bd_net [get_bd_pins xup_and4_1/y] [get_bd_pins xup_and3_0/b]
connect_bd_net [get_bd_pins xup_and4_2/y] [get_bd_pins xup_and3_0/c]
connect_bd_net -net R2_1 [get_bd_pins R2] [get_bd_pins xup_inv_10/a]
connect_bd_net -net R0_1 [get_bd_pins R0] [get_bd_pins xup_inv_8/a]
connect_bd_net [get_bd_pins xup_inv_4/y] [get_bd_pins xup_and4_1/a]
connect_bd_net -net C2_1 [get_bd_pins C2] [get_bd_pins xup_inv_2/a]
connect_bd_net -net C1_1 [get_bd_pins C1] [get_bd_pins xup_inv_1/a]
connect_bd_net [get_bd_pins xup_inv_9/y] [get_bd_pins xup_and4_2/b]
connect_bd_net -net R1_1 [get_bd_pins R1] [get_bd_pins xup_inv_9/a]
connect_bd_net [get_bd_pins xup_inv_6/y] [get_bd_pins xup_and4_1/c]
connect_bd_net -net L1_1 [get_bd_pins L1] [get_bd_pins xup_inv_5/a]
connect_bd_net [get_bd_pins xup_inv_0/y] [get_bd_pins xup_and4_0/a]
connect_bd_net [get_bd_pins xup_inv_10/y] [get_bd_pins xup_and4_2/c]
connect_bd_net [get_bd_pins xup_inv_8/y] [get_bd_pins xup_and4_2/a]
connect_bd_net -net L2_1 [get_bd_pins L2] [get_bd_pins xup_inv_6/a]
connect_bd_net [get_bd_pins xup_inv_5/y] [get_bd_pins xup_and4_1/b]
connect_bd_net -net L0_1 [get_bd_pins L0] [get_bd_pins xup_inv_4/a]
connect_bd_net [get_bd_pins xup_inv_1/y] [get_bd_pins xup_and4_0/b]
connect_bd_net [get_bd_pins xup_inv_2/y] [get_bd_pins xup_and4_0/c]
connect_bd_net -net C0_1 [get_bd_pins C0] [get_bd_pins xup_inv_0/a]
connect_bd_net -net C3_1 [get_bd_pins C3] [get_bd_pins xup_and4_0/d]
connect_bd_net -net L3_1 [get_bd_pins L3] [get_bd_pins xup_and4_1/d]
connect_bd_net -net R3_1 [get_bd_pins R3] [get_bd_pins xup_and4_2/d]
connect_bd_net [get_bd_pins xup_and3_0/y] [get_bd_pins y]

current_bd_instance /Regular_Credit/TRIPLE/TRIPLE_0
connect_bd_net [get_bd_pins xup_and4_0/y] [get_bd_pins xup_and3_0/a]
connect_bd_net [get_bd_pins xup_and4_1/y] [get_bd_pins xup_and3_0/b]
connect_bd_net [get_bd_pins xup_and4_2/y] [get_bd_pins xup_and3_0/c]
connect_bd_net -net C0_1 [get_bd_pins C0] [get_bd_pins xup_inv_0/a]
connect_bd_net [get_bd_pins xup_inv_0/y] [get_bd_pins xup_and4_0/a]
connect_bd_net -net C1_1 [get_bd_pins C1] [get_bd_pins xup_inv_1/a]
connect_bd_net [get_bd_pins xup_inv_1/y] [get_bd_pins xup_and4_0/b]
connect_bd_net -net C2_1 [get_bd_pins C2] [get_bd_pins xup_inv_2/a]
connect_bd_net [get_bd_pins xup_inv_2/y] [get_bd_pins xup_and4_0/c]
connect_bd_net -net C3_1 [get_bd_pins C3] [get_bd_pins xup_inv_3/a]
connect_bd_net [get_bd_pins xup_inv_3/y] [get_bd_pins xup_and4_0/d]
connect_bd_net -net L0_1 [get_bd_pins L0] [get_bd_pins xup_inv_4/a]
connect_bd_net [get_bd_pins xup_inv_4/y] [get_bd_pins xup_and4_1/a]
connect_bd_net -net L1_1 [get_bd_pins L1] [get_bd_pins xup_inv_5/a]
connect_bd_net [get_bd_pins xup_inv_5/y] [get_bd_pins xup_and4_1/b]
connect_bd_net -net L2_1 [get_bd_pins L2] [get_bd_pins xup_inv_6/a]
connect_bd_net [get_bd_pins xup_inv_6/y] [get_bd_pins xup_and4_1/c]
connect_bd_net -net L3_1 [get_bd_pins L3] [get_bd_pins xup_inv_7/a]
connect_bd_net [get_bd_pins xup_inv_7/y] [get_bd_pins xup_and4_1/d]
connect_bd_net -net R0_1 [get_bd_pins R0] [get_bd_pins xup_inv_8/a]
connect_bd_net [get_bd_pins xup_inv_8/y] [get_bd_pins xup_and4_2/a]
connect_bd_net -net R1_1 [get_bd_pins R1] [get_bd_pins xup_inv_9/a]
connect_bd_net [get_bd_pins xup_inv_9/y] [get_bd_pins xup_and4_2/b]
connect_bd_net -net R2_1 [get_bd_pins R2] [get_bd_pins xup_inv_10/a]
connect_bd_net [get_bd_pins xup_inv_10/y] [get_bd_pins xup_and4_2/c]
connect_bd_net -net R3_1 [get_bd_pins R3] [get_bd_pins xup_inv_11/a]
connect_bd_net [get_bd_pins xup_inv_11/y] [get_bd_pins xup_and4_2/d]
connect_bd_net [get_bd_pins xup_and3_0/y] [get_bd_pins y]

current_bd_instance /Regular_Credit/TRIPLE/TRIPLE_1
connect_bd_net [get_bd_pins xup_and4_0/y] [get_bd_pins xup_and3_0/a]
connect_bd_net [get_bd_pins xup_and4_1/y] [get_bd_pins xup_and3_0/b]
connect_bd_net [get_bd_pins xup_and4_2/y] [get_bd_pins xup_and3_0/c]
connect_bd_net -net C1_1 [get_bd_pins C1] [get_bd_pins xup_inv_1/a]
connect_bd_net [get_bd_pins xup_inv_1/y] [get_bd_pins xup_and4_0/b]
connect_bd_net -net C2_1 [get_bd_pins C2] [get_bd_pins xup_inv_2/a]
connect_bd_net [get_bd_pins xup_inv_2/y] [get_bd_pins xup_and4_0/c]
connect_bd_net -net C3_1 [get_bd_pins C3] [get_bd_pins xup_inv_3/a]
connect_bd_net [get_bd_pins xup_inv_3/y] [get_bd_pins xup_and4_0/d]
connect_bd_net -net L1_1 [get_bd_pins L1] [get_bd_pins xup_inv_5/a]
connect_bd_net [get_bd_pins xup_inv_5/y] [get_bd_pins xup_and4_1/b]
connect_bd_net -net L2_1 [get_bd_pins L2] [get_bd_pins xup_inv_6/a]
connect_bd_net [get_bd_pins xup_inv_6/y] [get_bd_pins xup_and4_1/c]
connect_bd_net -net L3_1 [get_bd_pins L3] [get_bd_pins xup_inv_7/a]
connect_bd_net [get_bd_pins xup_inv_7/y] [get_bd_pins xup_and4_1/d]
connect_bd_net -net R1_1 [get_bd_pins R1] [get_bd_pins xup_inv_9/a]
connect_bd_net [get_bd_pins xup_inv_9/y] [get_bd_pins xup_and4_2/b]
connect_bd_net -net R2_1 [get_bd_pins R2] [get_bd_pins xup_inv_10/a]
connect_bd_net [get_bd_pins xup_inv_10/y] [get_bd_pins xup_and4_2/c]
connect_bd_net -net R3_1 [get_bd_pins R3] [get_bd_pins xup_inv_11/a]
connect_bd_net [get_bd_pins xup_inv_11/y] [get_bd_pins xup_and4_2/d]
connect_bd_net -net C0_1 [get_bd_pins C0] [get_bd_pins xup_and4_0/a]
connect_bd_net -net L0_1 [get_bd_pins L0] [get_bd_pins xup_and4_1/a]
connect_bd_net -net R0_1 [get_bd_pins R0] [get_bd_pins xup_and4_2/a]
connect_bd_net [get_bd_pins xup_and3_0/y] [get_bd_pins y]
